# Altium schematic sheet S6-EXP-Bridge.SchDoc: Fysetc S6 BTT EXP-MOT Bridge
size Letter; Author: matt; CompanyName: Annex Engineering; DrawnBy: matt; Engineer: matt; Organization: Annex Engineering; DocumentNumber: 1; Revision: 1; SheetNumber: 1; SheetTotal: 1
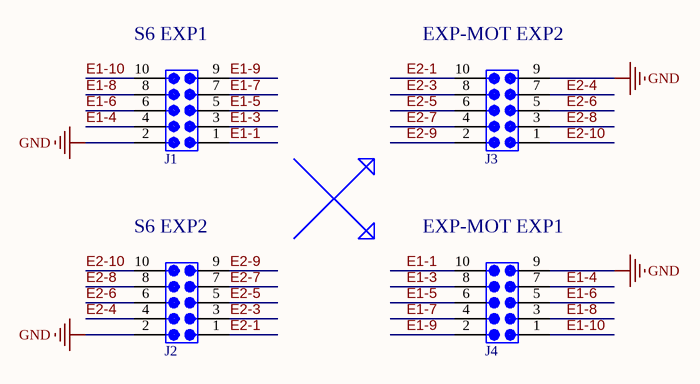
[diagram p0: S6-EXP-Bridge.SchDoc]

## Parts
J1  SFH11-PBPC-D05-ST-BK  [R2X5]  (value not drawn)
J2  SFH11-PBPC-D05-ST-BK  [R2X5]  (value not drawn)
J3  SFH11-PBPC-D05-ST-BK  [R2X5]  (value not drawn)
J4  SFH11-PBPC-D05-ST-BK  [R2X5]  (value not drawn)

## Nets
GND: J1.2 J2.2 J3.9 J4.9
E1-1: J1.1 J4.10
E1-3: J1.3 J4.8
E1-4: J1.4 J4.7
E1-5: J1.5 J4.6
E1-6: J1.6 J4.5
E1-7: J1.7 J4.4
E1-8: J1.8 J4.3
E1-9: J1.9 J4.2
E1-10: J1.10 J4.1
E2-1: J2.1 J3.10
E2-3: J2.3 J3.8
E2-4: J2.4 J3.7
E2-5: J2.5 J3.6
E2-6: J2.6 J3.5
E2-7: J2.7 J3.4
E2-8: J2.8 J3.3
E2-9: J2.9 J3.2
E2-10: J2.10 J3.1

## Notes on the sheet
- (near J1) S6 EXP1
- (near J3) EXP-MOT EXP2
- (near J2) S6 EXP2
- (near J4) EXP-MOT EXP1
- Title
- Size:
- Date:
- Letter
- Number:
- Time:
- Revision:
- Sheet
- of
- File:

## Library data of the parts
J1-J4 = R100_2x5: 2x5 2.54mm Pin Receptacle; Manufacturer 1: Sullins; Connector Type: Header,Socket; Number of Positions: 10; Pitch: 0.1inch; Supplier 1: Digi-Key; Supplier Part Number 1: S9194-ND; Manufacturer Part Number 1: SFH11-PBPC-D05-ST-BK; Stock 1: 22341; Pricing 1: 1=0.66000, 10=0.57600, 100=0.49700, 500=0.40662, 1000=0.36144, 5000=0.32630 (USD); RoHS: Yes; Mount: Through Hole; Contact Plating: Gold; Color: Black; Termination: Solder; Package Quantity: 1; Number of Rows: 2; Packaging: Tray; Row Spacing: 0.1inch; Lead Free: Lead Free; ComponentLink1URL: https://datasheet.ciiva.com/754/sfh11-pxxc-dxx-st-xx11160-c-754555.pdf?src-supplier=Digi-Key; ComponentLink1Description: https://datasheet.ciiva.com/754/sfh11-pxxc-dxx-st-xx11160-c-754555.pdf?src-supplier=Digi-Key